# Altium schematic sheet Sheet1_BUS_DATN.SchDoc
size A4; SheetNumber: 1; SheetTotal: 1
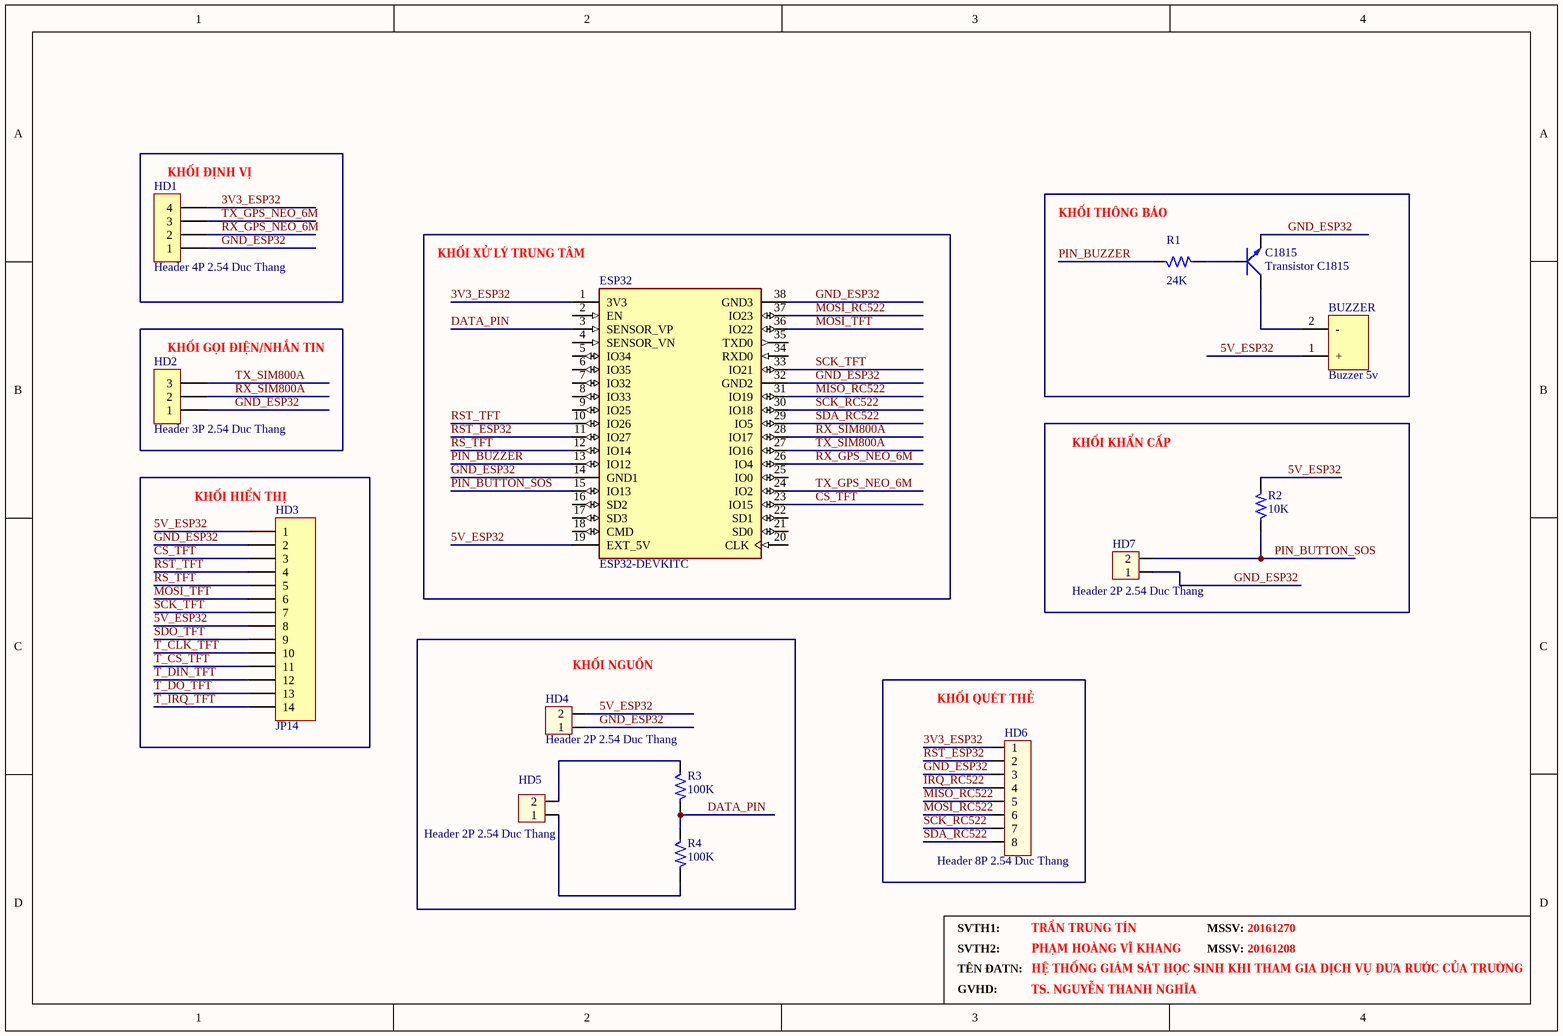
[diagram p0: Sheet1_BUS_DATN.SchDoc]

## Parts
BUZZER  Buzzer 5v  [Buzzer 5v]
C1815  Transistor C1815  [TO126]
ESP32  ESP32-DEVKITC  [MODULE_ESP32-DEVKITC]
HD1  Header 4P 2.54 Duc Thang  [XH2.54M-4]
HD2  Header 3P 2.54 Duc Thang  [XH2.54M-3]
HD3  JP14  [JP14-C1T]
HD4  Header 2P 2.54 Duc Thang  [XH2.54M-2]
HD5  Header 2P 2.54 Duc Thang  [XH2.54M-2]
HD6  Header 8P 2.54 Duc Thang  [XH2.54M-8]
HD7  Header 2P 2.54 Duc Thang  [XH2.54M-2]
R1  24K  [R1/4W]
R2  10K  [R1/4W]
R3  100K  [R1/4W]
R4  100K  [R1/4W]

## Nets
3V3_ESP32: ESP32.1(3V3) HD1.4 HD6.1
5V_ESP32: BUZZER.1(+) ESP32.19(EXT_5V) HD3.1 HD3.8 HD4.2 R2.2
CS_TFT: ESP32.23(IO15) HD3.3
DATA_PIN: ESP32.3(SENSOR_VP) R3.2 R4.1
GND_ESP32: C1815.3(E) ESP32.14(GND1) ESP32.32(GND2) ESP32.38(GND3) HD1.1 HD2.1 HD3.2 HD4.1 HD6.3 HD7.1
IRQ_RC522: HD6.4
MISO_RC522: ESP32.31(IO19) HD6.5
MOSI_RC522: ESP32.37(IO23) HD6.6
MOSI_TFT: ESP32.36(IO22) HD3.6
PIN_BUTTON_SOS: ESP32.15(IO13) HD7.2 R2.1
PIN_BUZZER: ESP32.13(IO12) R1.1
RS_TFT: ESP32.12(IO14) HD3.5
RST_ESP32: ESP32.11(IO27) HD6.2
RST_TFT: ESP32.10(IO26) HD3.4
RX_GPS_NEO_6M: ESP32.26(IO4) HD1.2
RX_SIM800A: ESP32.28(IO17) HD2.2
SCK_RC522: ESP32.30(IO18) HD6.7
SCK_TFT: ESP32.33(IO21) HD3.7
SDA_RC522: ESP32.29(IO5) HD6.8
SDO_TFT: HD3.9
T_CLK_TFT: HD3.10
T_CS_TFT: HD3.11
T_DIN_TFT: HD3.12
T_DO_TFT: HD3.13
T_IRQ_TFT: HD3.14
TX_GPS_NEO_6M: ESP32.24(IO2) HD1.3
TX_SIM800A: ESP32.27(IO16) HD2.3
NetBUZZER_2: BUZZER.2(-) C1815.2(C)
NetC1815_1: C1815.1(B) R1.2
NetHD5_1: HD5.1 R4.2
NetHD5_2: HD5.2 R3.1

Not connected (* = marked no-connect by the designer): ESP32 2(EN) 4(SENSOR_VN) 5(IO34) 6(IO35) 7(IO32) 8(IO33) 9(IO25) 16(SD2) 17(SD3) 18(CMD) 20(CLK) 21(SD0) 22(SD1) 25(IO0) 34(RXD0) 35(TXD0)

## Notes on the sheet
- (near HD1) KHỐI ĐỊNH VỊ
- (near R1) KHỐI THÔNG BÁO
- KHỐI XỬ LÝ TRUNG TÂM
- (near HD2) KHỐI GỌI ĐIỆN/NHẮN TIN
- KHỐI KHẨN CẤP
- (near HD3) KHỐI HIỂN THỊ
- (near HD4) KHỐI NGUỒN
- (near HD6) KHỐI QUÉT THẺ
- SVTH1:
- SVTH2:
- TÊN ĐATN:
- TRẦN TRUNG TÍN
- PHẠM HOÀNG VĨ KHANG
- HỆ THỐNG GIÁM SÁT HỌC SINH KHI THAM GIA DỊCH VỤ ĐƯA RƯỚC CỦA TRƯỜNG
- MSSV:
- 20161270
- 20161208
- GVHD:
- TS. NGUYỄN THANH NGHĨA

## Library data of the parts
C1815 = C1815: NPN 600mW, ECB; Value: C1815
ESP32 = ESP32-DEVKITC: - Transceiver; 802.11 b/g/n _Wi-Fi, WiFi, WLAN_, BluetoothÂ® Smart Ready 4.x Dual Mode For Use With ESP-WROOM-32; MP: ESP32-DEVKITC-32D-F; MF: Espressif Systems; Price: None; SnapEDA_Link: https://www.snapeda.com/parts/ESP32-DEVKITC-32D-F/Espressif%20Systems/view-part/4220172/?ref=snap; Availability: Unavailable; Value: *; Package: None
HD1 = Header 4P 2.54 Duc Thang: Cắm; Ten_Linh_Kien: Header 4P XH2.54-4P Đực Thẳng; Don_Vi: Con; Ma_Hang: MH001285; Chung_Loai: Cắm
HD2 = Header 3P 2.54 Duc Thang: Cắm; Ten_Linh_Kien: Header 3P XH2.54-3P Đực Thẳng; Don_Vi: Con; Ma_Hang: MH001292; Chung_Loai: Cắm
HD3 = JP14: WR-PHD 2.54 mm Angled Socket Header; Manufacturer: W¨¹rth Elektronik eiSos GmbH; partNo: 613014143121; ComponentLink1 Description: Manufacturer; ComponentLink2 Description: Datasheet; NoPins: 14; Created Date: 29 March 2013; ComponentLink1URL: http://www.we-online.com; ComponentLink2URL: http://katalog.we-online.de/em/datasheet/6130xx143121.pdf; Created by: Karrer Zheng
HD4 HD5 HD7 = Header 2P 2.54 Duc Thang: Cắm; Ten_Linh_Kien: Header 2P XH2.54-2P Đực Thẳng; Don_Vi: Con; Ma_Hang: MH001283; Chung_Loai: Cắm
HD6 = Header 8P 2.54 Duc Thang: Cắm; Ten_Linh_Kien: Header 8P XH2.54-8P Đực Thẳng; Don_Vi: Con; Ma_Hang: MH003366; Chung_Loai: Cắm
R1-R4 = R: Resistor 1/4W; Value: R1/4W - 1K